# Altium schematic sheet 02.BlockDiagram.SchDoc: Block Diagram Page
size A3; DrawnBy: My My; Revision: 1.1; SheetNumber: 2; SheetTotal: 4
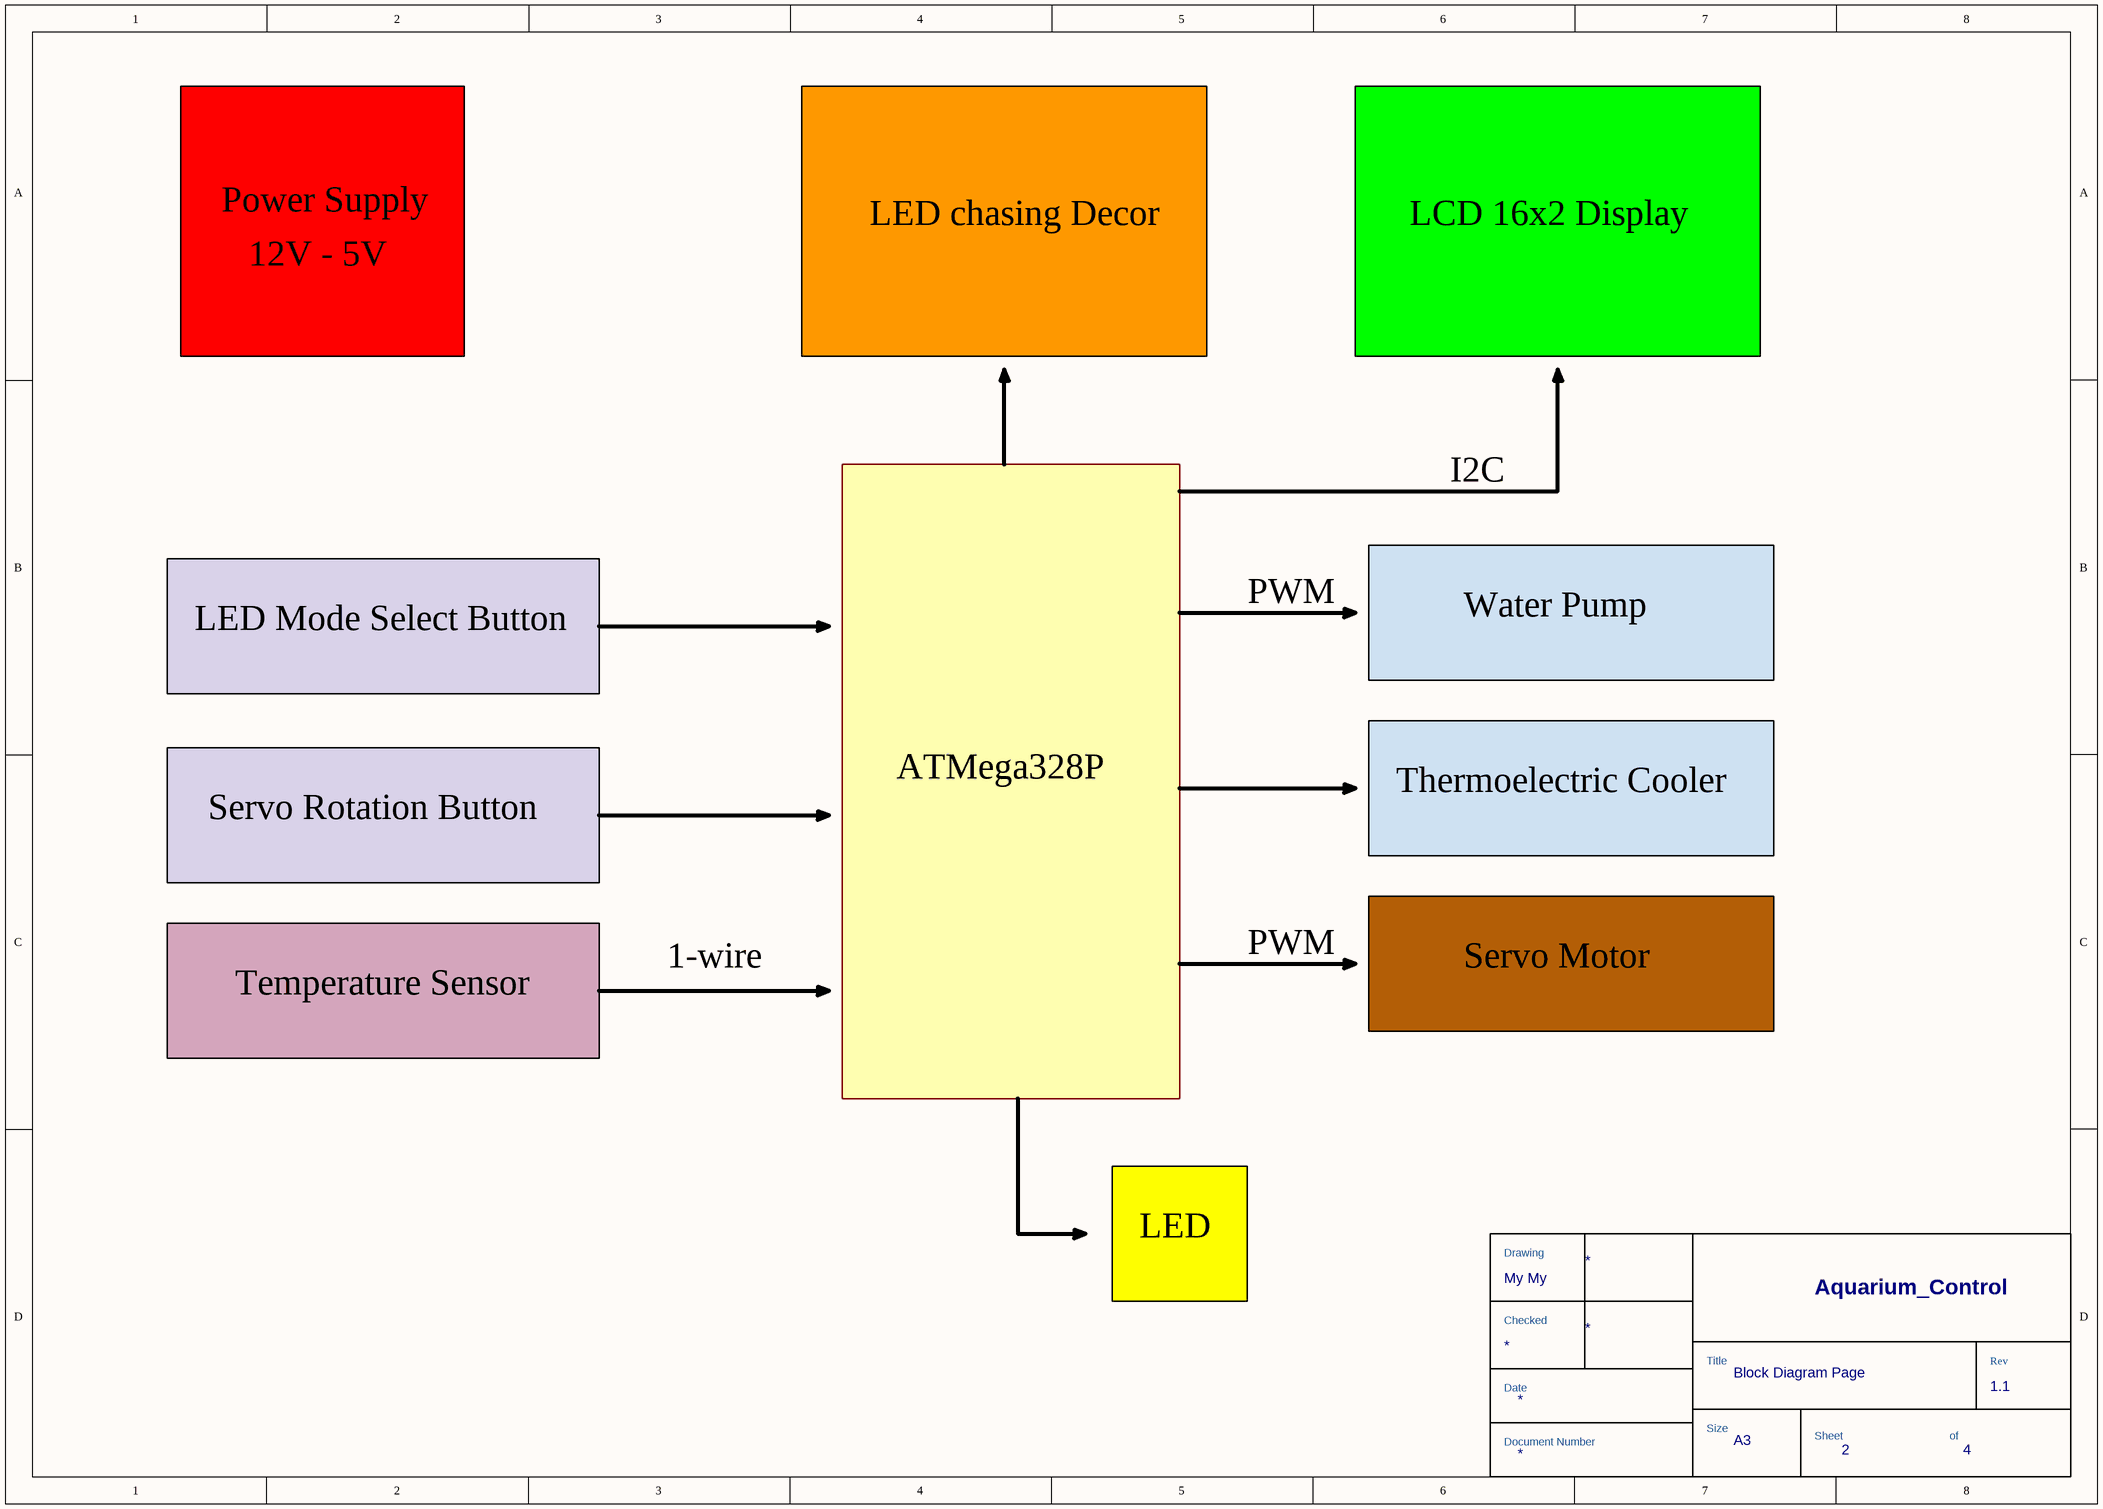
[diagram p0: 02.BlockDiagram.SchDoc]

## Parts
*  TitleBlock  (value not drawn)  (graphical)

## Notes on the sheet
- Power Supply
- LED chasing Decor
- LCD 16x2 Display
- 12V - 5V
- I2C
- LED Mode Select Button
- PWM
- Water Pump
- ATMega328P
- Servo Rotation Button
- Thermoelectric Cooler
- 1-wire
- Servo Motor
- Temperature Sensor
- LED
- (in symbol TitleBlock) Drawing; Aquarium_Control; Checked; Title; Rev; Date; Size; Sheet; of; Document Number; A3

## Library data of the parts
* = TitleBlock: Common Title Block